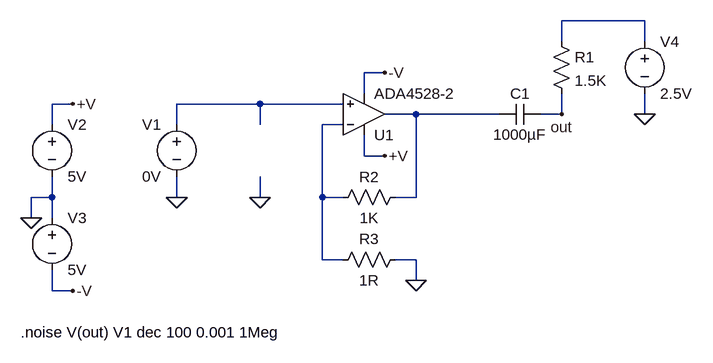
[diagram p0: schematic Digital LNA Front End.asc]
Digital LNA Front End.asc, the LTspice schematic file:
Version 4
SHEET 1 880 680
WIRE 656 -64 528 -64
WIRE 528 -32 528 -64
WIRE 656 -32 656 -64
WIRE 256 16 224 16
WIRE 224 48 224 16
WIRE -224 64 -256 64
WIRE 64 64 -64 64
WIRE 192 64 64 64
WIRE 304 80 256 80
WIRE 432 80 304 80
WIRE 528 80 528 48
WIRE 528 80 496 80
WIRE 656 80 656 48
WIRE -256 96 -256 64
WIRE -64 96 -64 64
WIRE 64 96 64 64
WIRE 192 96 160 96
WIRE 224 144 224 112
WIRE 256 144 224 144
WIRE -256 208 -256 176
WIRE -256 208 -288 208
WIRE -64 208 -64 176
WIRE 64 208 64 176
WIRE 160 208 160 96
WIRE 192 208 160 208
WIRE 304 208 304 80
WIRE 304 208 272 208
WIRE -288 240 -288 208
WIRE -256 240 -256 208
WIRE 160 304 160 208
WIRE 192 304 160 304
WIRE 304 304 272 304
WIRE 304 336 304 304
WIRE -256 352 -256 320
WIRE -224 352 -256 352
FLAG 64 208 0
FLAG -64 208 0
FLAG -288 240 0
FLAG -224 64 +V
FLAG -224 352 -V
FLAG 256 144 +V
FLAG 256 16 -V
FLAG 304 336 0
FLAG 528 80 out
FLAG 656 80 0
SYMBOL OpAmps\\ADA4528-2 224 144 M180
SYMATTR InstName U1
SYMBOL cap 496 64 R90
WINDOW 0 0 32 VBottom 2
WINDOW 3 32 32 VTop 2
SYMATTR InstName C1
SYMATTR Value 1000µF
SYMBOL res 512 -48 R0
SYMATTR InstName R1
SYMATTR Value 1.5K
SYMBOL voltage -64 80 M0
WINDOW 123 0 0 Left 0
WINDOW 39 0 0 Left 0
SYMATTR InstName V1
SYMATTR Value 0V
SYMBOL voltage -256 80 R0
WINDOW 123 0 0 Left 0
WINDOW 39 0 0 Left 0
SYMATTR InstName V2
SYMATTR Value 5V
SYMBOL voltage -256 224 R0
WINDOW 123 0 0 Left 0
WINDOW 39 0 0 Left 0
SYMATTR InstName V3
SYMATTR Value 5V
SYMBOL res 288 192 R90
WINDOW 0 0 56 VBottom 2
WINDOW 3 32 56 VTop 2
SYMATTR InstName R2
SYMATTR Value 1K
SYMBOL res 288 288 R90
WINDOW 0 0 56 VBottom 2
WINDOW 3 32 56 VTop 2
SYMATTR InstName R3
SYMATTR Value 1R
SYMBOL voltage 656 -48 R0
WINDOW 123 0 0 Left 0
WINDOW 39 0 0 Left 0
SYMATTR InstName V4
SYMATTR Value 2.5V
TEXT -304 416 Left 2 !.noise V(out) V1 dec 100 0.001 1Meg

The netlist it stands for:
* Digital LNA Front End.asc
XU1 N002 N004 +V -V N003 ADA4528-2  ; pins In+ In- V+ V- OUT
C1 out N003 1000µF
R1 N001 out 1.5K
V1 N002 0 0V
V2 +V 0 5V
V3 0 -V 5V
R2 N003 N004 1K
R3 0 N004 1R
V4 N001 0 2.5V
.noise V(out) V1 dec 100 0.001 1Meg
.backanno
.end